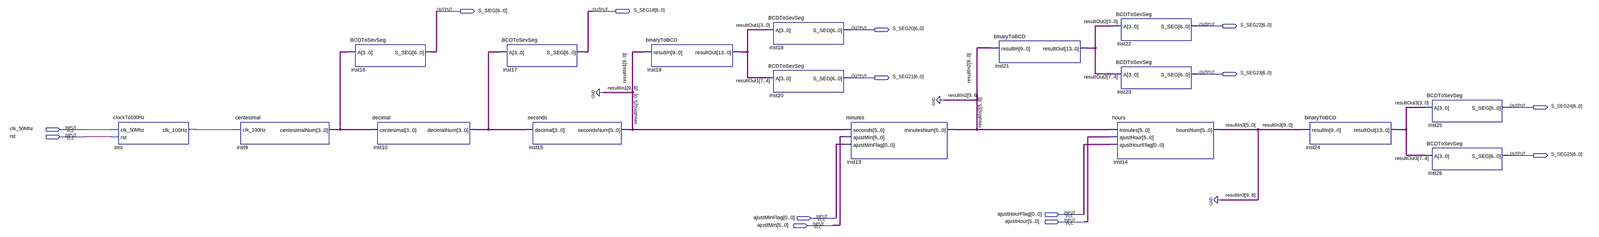
[diagram p0: schematic sheet, whole]
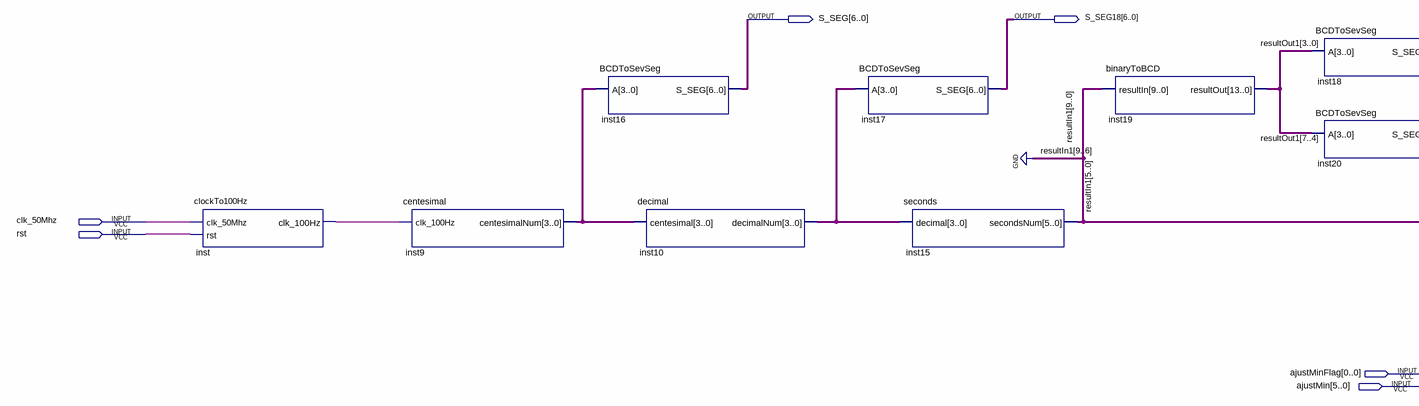
[diagram p1: schematic sheet, left part]
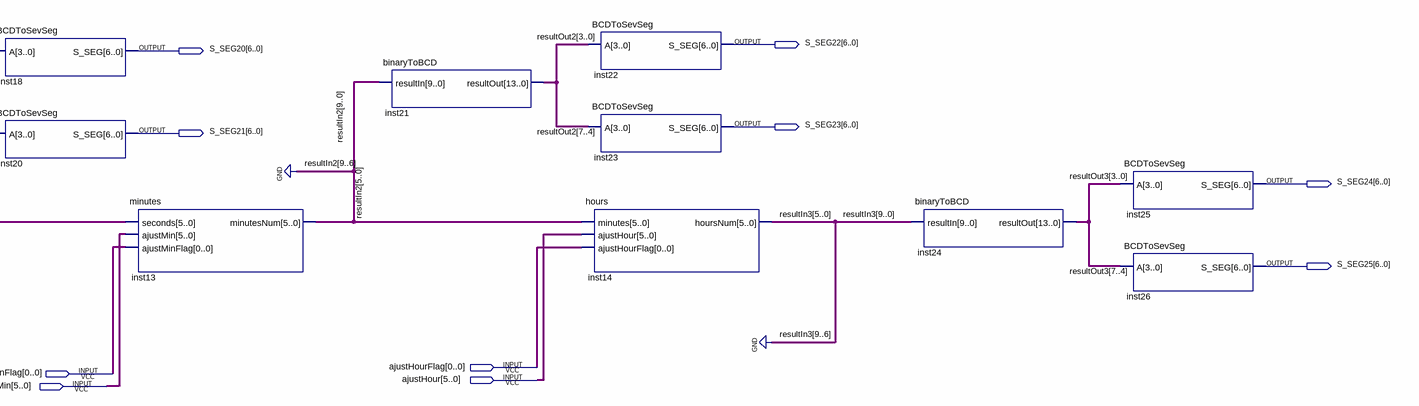
[diagram p2: schematic sheet, right part]
// Quartus schematic Sistema[Conflito].bdf as structural Verilog: 17 symbols, 14 pins
module \Sistema[Conflito]  (
  input  clk_50Mhz,
  input  rst,
  input  [0:0] ajustHourFlag,
  input  [0:0] ajustMinFlag,
  input  [5:0] ajustHour,
  input  [5:0] ajustMin,
  output [6:0] S_SEG,
  output [6:0] S_SEG18,
  output [6:0] S_SEG22,
  output [6:0] S_SEG20,
  output [6:0] S_SEG23,
  output [6:0] S_SEG21,
  output [6:0] S_SEG24,
  output [6:0] S_SEG25
);

  wire inst_clk_100hz;
  wire [3:0] inst9_centesimalnum, inst10_decimalnum;
  wire [5:0] resultIn1, resultIn2, resultIn3;
  wire [13:0] resultOut1, resultOut2, resultOut3;

  clockTo100Hz inst (.clk_50Mhz(clk_50Mhz), .rst(rst), .clk_100Hz(inst_clk_100hz));
  centesimal inst9 (.clk_100Hz(inst_clk_100hz), .centesimalNum(inst9_centesimalnum));
  BCDToSevSeg inst16 (.A(inst9_centesimalnum), .S_SEG(S_SEG));
  decimal inst10 (.centesimal(inst9_centesimalnum), .decimalNum(inst10_decimalnum));
  BCDToSevSeg inst17 (.A(inst10_decimalnum), .S_SEG(S_SEG18));
  seconds inst15 (.decimal(inst10_decimalnum), .secondsNum(resultIn1));
  binaryToBCD inst19 (.resultIn({4'b0000, resultIn1}), .resultOut(resultOut1));
  BCDToSevSeg inst18 (.A(resultOut1[3:0]), .S_SEG(S_SEG20));
  BCDToSevSeg inst20 (.A(resultOut1[7:4]), .S_SEG(S_SEG21));
  minutes inst13 (.seconds(resultIn1), .ajustMin(ajustMin), .ajustMinFlag(ajustMinFlag[0]), .minutesNum(resultIn2));
  binaryToBCD inst21 (.resultIn({4'b0000, resultIn2}), .resultOut(resultOut2));
  BCDToSevSeg inst22 (.A(resultOut2[3:0]), .S_SEG(S_SEG22));
  BCDToSevSeg inst23 (.A(resultOut2[7:4]), .S_SEG(S_SEG23));
  hours inst14 (.minutes(resultIn2), .ajustHour(ajustHour), .ajustHourFlag(ajustHourFlag[0]), .hoursNum(resultIn3));
  binaryToBCD inst24 (.resultIn({4'b0000, resultIn3}), .resultOut(resultOut3));
  BCDToSevSeg inst25 (.A(resultOut3[3:0]), .S_SEG(S_SEG24));
  BCDToSevSeg inst26 (.A(resultOut3[7:4]), .S_SEG(S_SEG25));
endmodule
